# EasyEDA Pro project ProPrj_智能车主控V5.0-20251108_2026-08-26.epro, schematic Schematic2_1

## Sheets
1 P1: Assembly Variant: Basic; Board Name: Board1; Create Date: 2026-05-15; Page Name: P1; Project Name: 飞檐走壁V3.0; Schematic Name: Schematic2; Update Date: 2026-05-15; Company: 嘉立创EDA; Page Size: A4; Version: V1.0
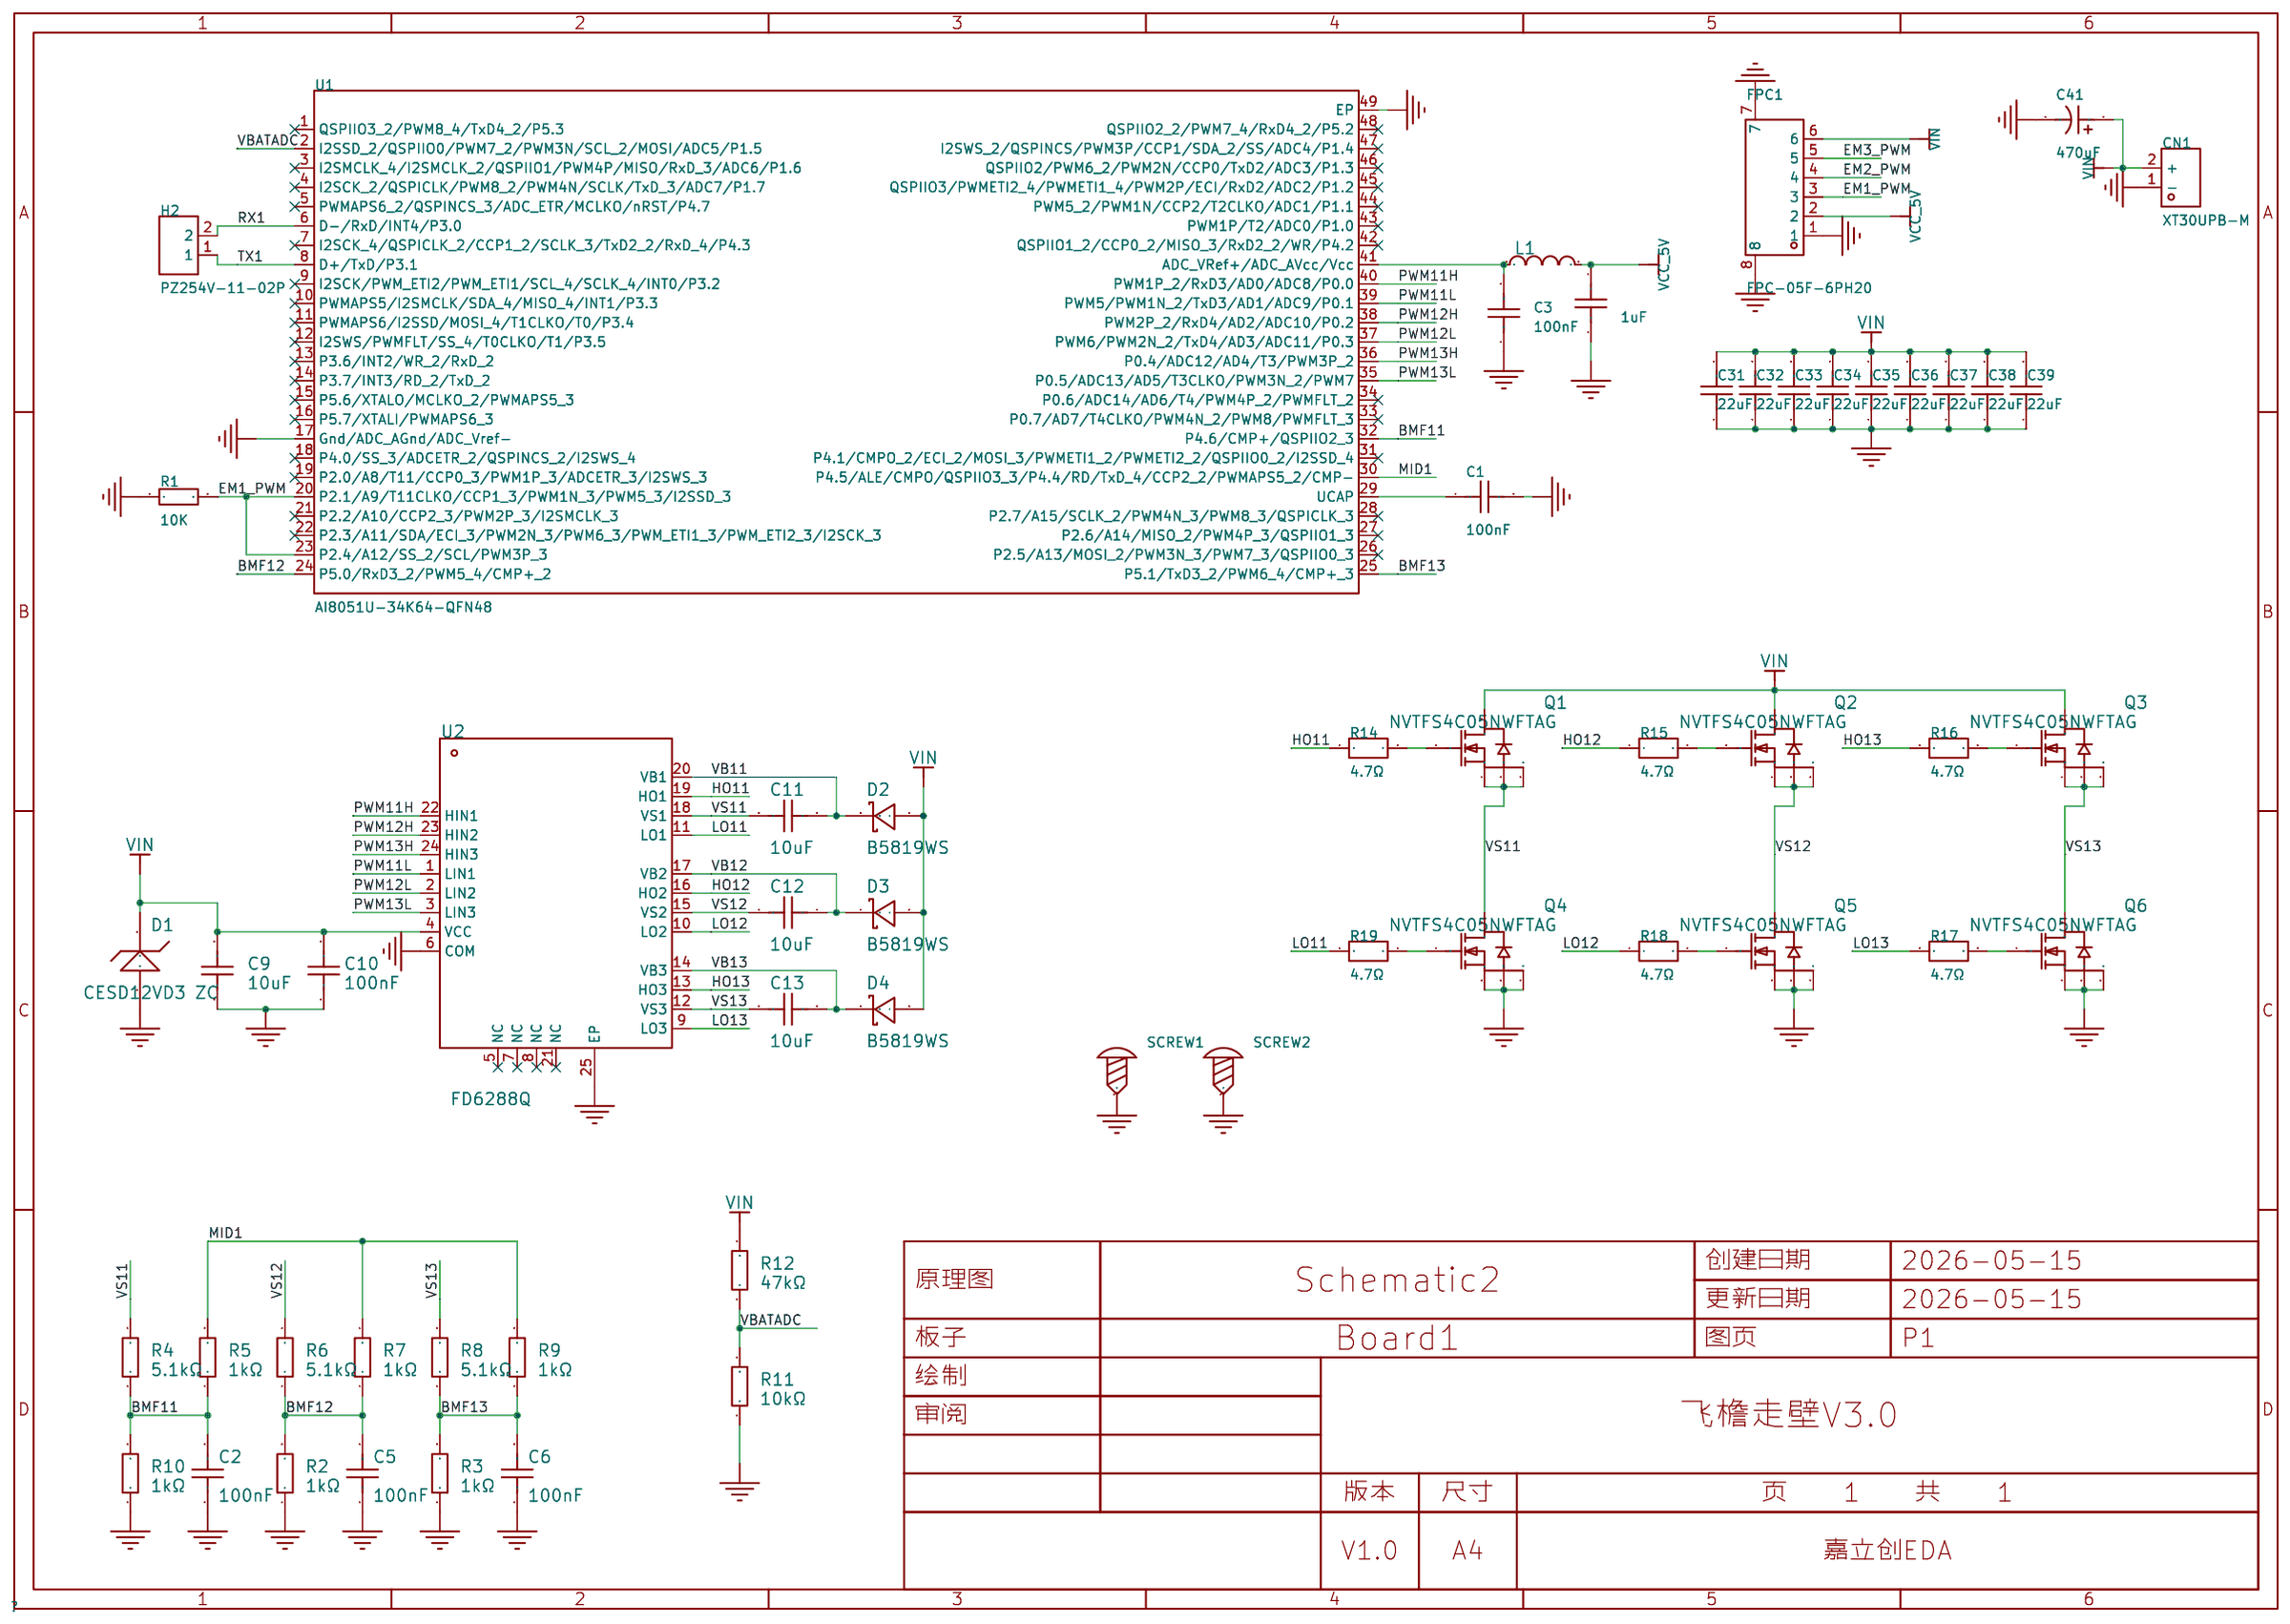
[diagram p2: P1]
2 P2: Board Name: 电调; Page Name: P2
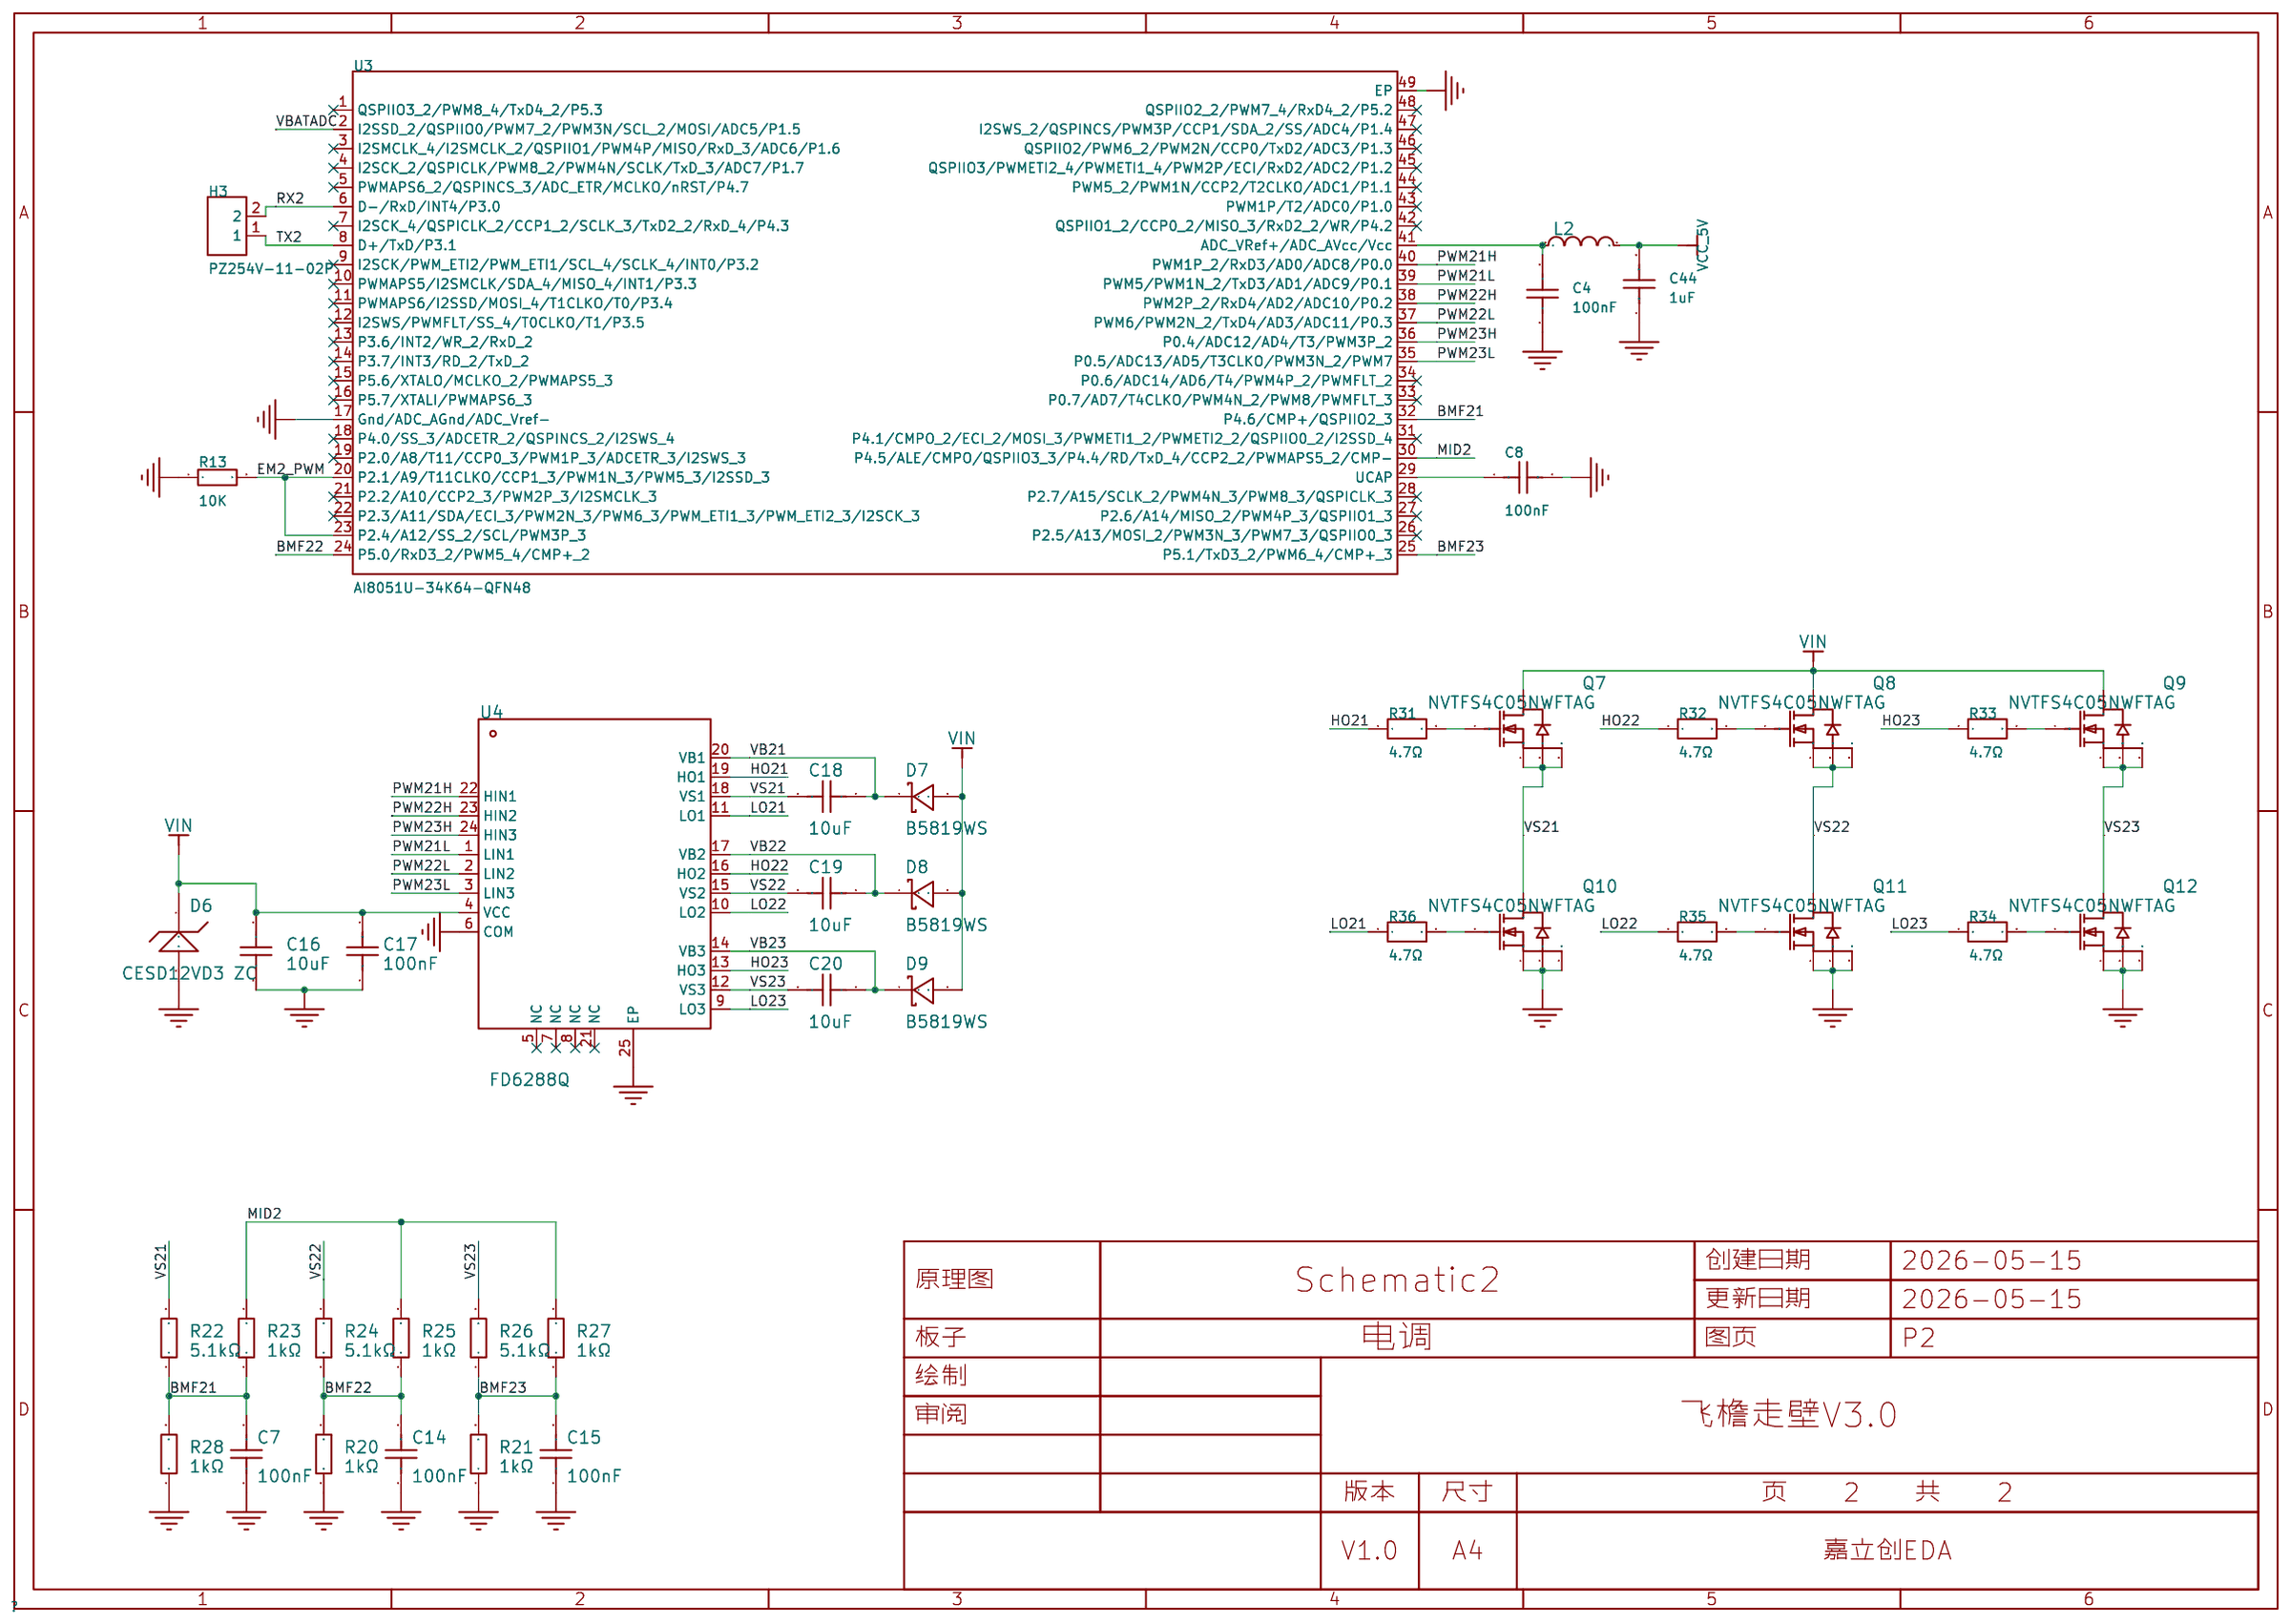
[diagram p3: P2]
3 P3: Board Name: 电调; Page Name: P3
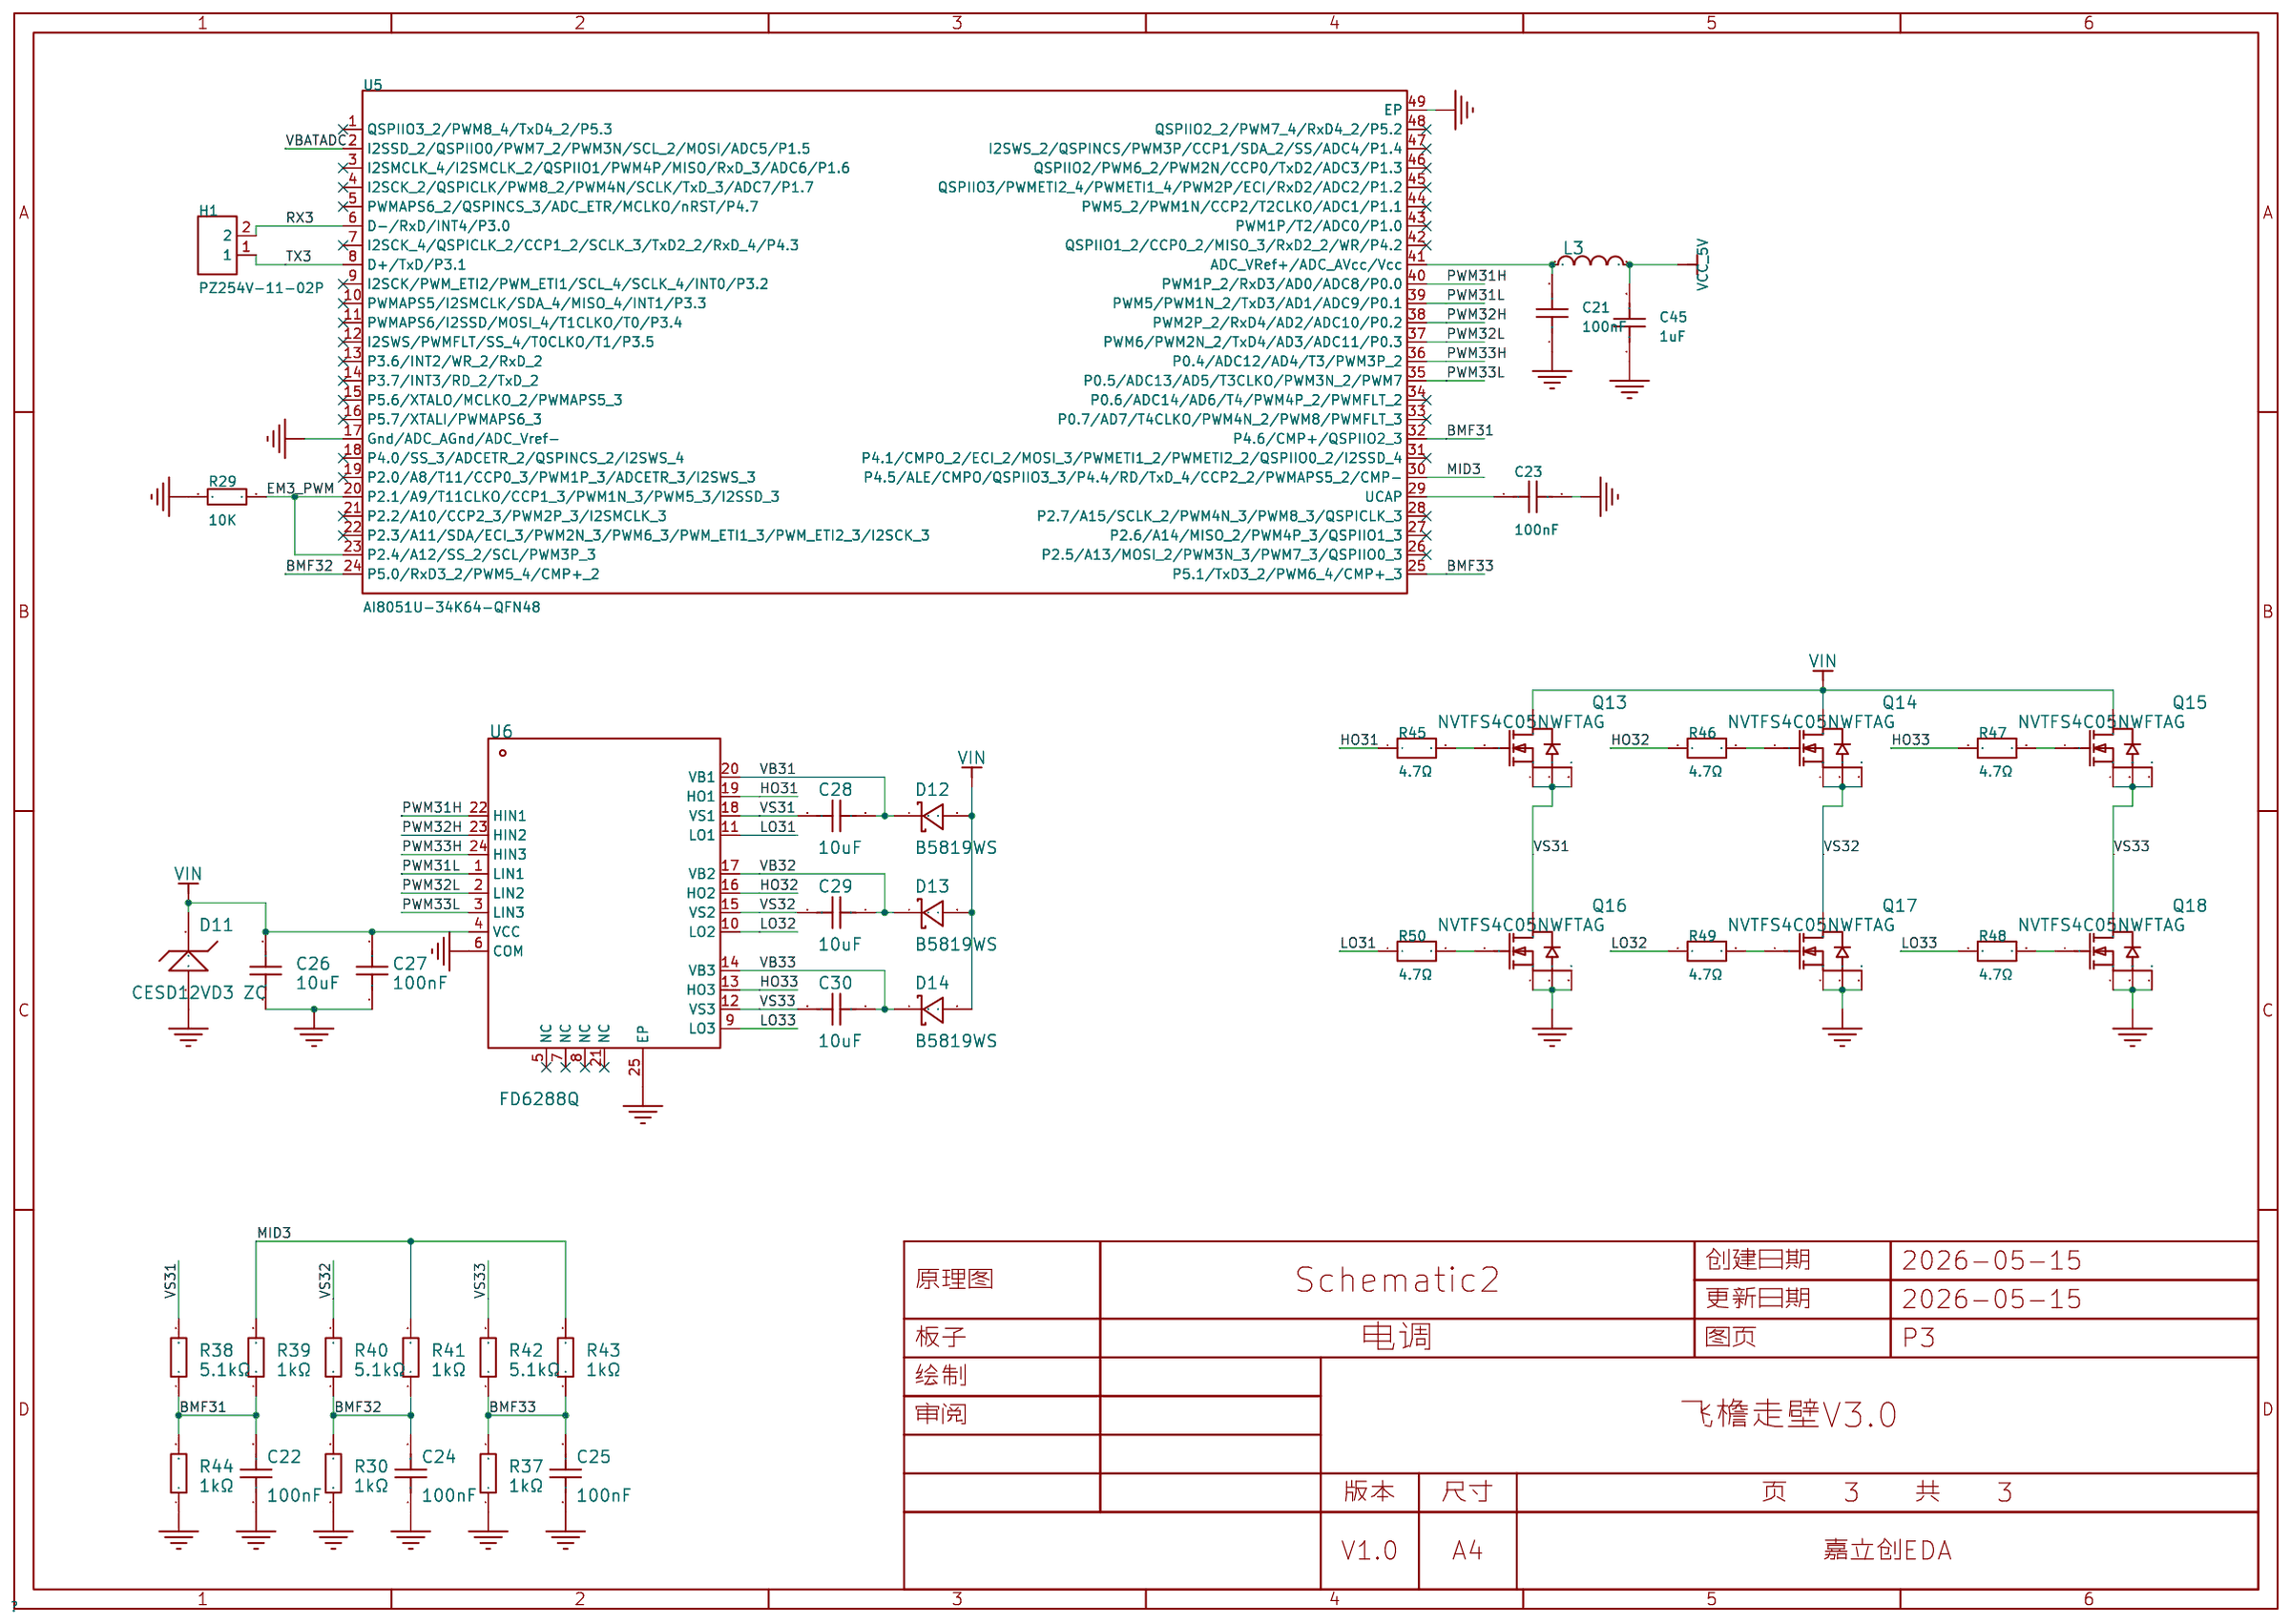
[diagram p4: P3]

## Parts
sheet P1
C1  100nF  [C0603]
C2  100nF  [C0603]
C3  100nF  [C0603]
C5  100nF  [C0603]
C6  100nF  [C0603]
C9  10uF  [C0603]
C10  100nF  [C0603]
C11  10uF  [C0603]
C12  10uF  [C0603]
C13  10uF  [C0603]
C31  22uF  [C0805]
C32  22uF  [C0805]
C33  22uF  [C0805]
C34  22uF  [C0805]
C35  22uF  [C0805]
C36  22uF  [C0805]
C37  22uF  [C0805]
C38  22uF  [C0805]
C39  22uF  [C0805]
C41  470uF  [CAP-TH_BD6.3-P2.50-D0.6-FD]
C42  1uF  [C0603]
CN1  XT30UPB-M  [CONN-TH_XT30UPB-M]
D1  CESD12VD3 ZC  [SOD-323_L1.8-W1.3-LS2.5-RD]
D2  B5819WS  [SOD-323_L1.8-W1.3-LS2.5-RD]
D3  B5819WS  [SOD-323_L1.8-W1.3-LS2.5-RD]
D4  B5819WS  [SOD-323_L1.8-W1.3-LS2.5-RD]
FPC1  FPC-05F-6PH20  [FPC-SMD_6P-P0.50_XUNPU_FPC-05F-6PH20]
H2  PZ254V-11-02P  [HDR-TH_2P-P2.54-V-M]
L1  BLM18EG221SN1D  [L0603]
Q1  NVTFS4C05NWFTAG  [WDFN-5_L3.3-W3.3-P0.65-BL]
Q2  NVTFS4C05NWFTAG  [WDFN-5_L3.3-W3.3-P0.65-BL]
Q3  NVTFS4C05NWFTAG  [WDFN-5_L3.3-W3.3-P0.65-BL]
Q4  NVTFS4C05NWFTAG  [WDFN-5_L3.3-W3.3-P0.65-BL]
Q5  NVTFS4C05NWFTAG  [WDFN-5_L3.3-W3.3-P0.65-BL]
Q6  NVTFS4C05NWFTAG  [WDFN-5_L3.3-W3.3-P0.65-BL]
R1  10K  [R0603]
R2  1kΩ  [R0603]
R3  1kΩ  [R0603]
R4  5.1kΩ  [R0603]
R5  1kΩ  [R0603]
R6  5.1kΩ  [R0603]
R7  1kΩ  [R0603]
R8  5.1kΩ  [R0603]
R9  1kΩ  [R0603]
R10  1kΩ  [R0603]
R11  10kΩ  [R0603]
R12  47kΩ  [R0603]
R14  4.7Ω  [R0603]
R15  4.7Ω  [R0603]
R16  4.7Ω  [R0603]
R17  4.7Ω  [R0603]
R18  4.7Ω  [R0603]
R19  4.7Ω  [R0603]
SCREW1  -  [M2螺丝]
SCREW2  -  [M2螺丝]
U1  AI8051U-34K64-QFN48  [UQFN-48_L6.0-W6.0-P0.40-BL-EP4.4]
U2  FD6288Q  [QFN-24_L4.0-W4.0-P0.50-BL-EP2.6]
sheet P2
C4  100nF  [C0603]
C7  100nF  [C0603]
C8  100nF  [C0603]
C14  100nF  [C0603]
C15  100nF  [C0603]
C16  10uF  [C0603]
C17  100nF  [C0603]
C18  10uF  [C0603]
C19  10uF  [C0603]
C20  10uF  [C0603]
C44  1uF  [C0603]
D6  CESD12VD3 ZC  [SOD-323_L1.8-W1.3-LS2.5-RD]
D7  B5819WS  [SOD-323_L1.8-W1.3-LS2.5-RD]
D8  B5819WS  [SOD-323_L1.8-W1.3-LS2.5-RD]
D9  B5819WS  [SOD-323_L1.8-W1.3-LS2.5-RD]
H3  PZ254V-11-02P  [HDR-TH_2P-P2.54-V-M]
L2  BLM18EG221SN1D  [L0603]
Q7  NVTFS4C05NWFTAG  [WDFN-5_L3.3-W3.3-P0.65-BL]
Q8  NVTFS4C05NWFTAG  [WDFN-5_L3.3-W3.3-P0.65-BL]
Q9  NVTFS4C05NWFTAG  [WDFN-5_L3.3-W3.3-P0.65-BL]
Q10  NVTFS4C05NWFTAG  [WDFN-5_L3.3-W3.3-P0.65-BL]
Q11  NVTFS4C05NWFTAG  [WDFN-5_L3.3-W3.3-P0.65-BL]
Q12  NVTFS4C05NWFTAG  [WDFN-5_L3.3-W3.3-P0.65-BL]
R13  10K  [R0603]
R20  1kΩ  [R0603]
R21  1kΩ  [R0603]
R22  5.1kΩ  [R0603]
R23  1kΩ  [R0603]
R24  5.1kΩ  [R0603]
R25  1kΩ  [R0603]
R26  5.1kΩ  [R0603]
R27  1kΩ  [R0603]
R28  1kΩ  [R0603]
R31  4.7Ω  [R0603]
R32  4.7Ω  [R0603]
R33  4.7Ω  [R0603]
R34  4.7Ω  [R0603]
R35  4.7Ω  [R0603]
R36  4.7Ω  [R0603]
U3  AI8051U-34K64-QFN48  [UQFN-48_L6.0-W6.0-P0.40-BL-EP4.4]
U4  FD6288Q  [QFN-24_L4.0-W4.0-P0.50-BL-EP2.6]
sheet P3
C21  100nF  [C0603]
C22  100nF  [C0603]
C23  100nF  [C0603]
C24  100nF  [C0603]
C25  100nF  [C0603]
C26  10uF  [C0603]
C27  100nF  [C0603]
C28  10uF  [C0603]
C29  10uF  [C0603]
C30  10uF  [C0603]
C45  1uF  [C0603]
D11  CESD12VD3 ZC  [SOD-323_L1.8-W1.3-LS2.5-RD]
D12  B5819WS  [SOD-323_L1.8-W1.3-LS2.5-RD]
D13  B5819WS  [SOD-323_L1.8-W1.3-LS2.5-RD]
D14  B5819WS  [SOD-323_L1.8-W1.3-LS2.5-RD]
H1  PZ254V-11-02P  [HDR-TH_2P-P2.54-V-M]
L3  BLM18EG221SN1D  [L0603]
Q13  NVTFS4C05NWFTAG  [WDFN-5_L3.3-W3.3-P0.65-BL]
Q14  NVTFS4C05NWFTAG  [WDFN-5_L3.3-W3.3-P0.65-BL]
Q15  NVTFS4C05NWFTAG  [WDFN-5_L3.3-W3.3-P0.65-BL]
Q16  NVTFS4C05NWFTAG  [WDFN-5_L3.3-W3.3-P0.65-BL]
Q17  NVTFS4C05NWFTAG  [WDFN-5_L3.3-W3.3-P0.65-BL]
Q18  NVTFS4C05NWFTAG  [WDFN-5_L3.3-W3.3-P0.65-BL]
R29  10K  [R0603]
R30  1kΩ  [R0603]
R37  1kΩ  [R0603]
R38  5.1kΩ  [R0603]
R39  1kΩ  [R0603]
R40  5.1kΩ  [R0603]
R41  1kΩ  [R0603]
R42  5.1kΩ  [R0603]
R43  1kΩ  [R0603]
R44  1kΩ  [R0603]
R45  4.7Ω  [R0603]
R46  4.7Ω  [R0603]
R47  4.7Ω  [R0603]
R48  4.7Ω  [R0603]
R49  4.7Ω  [R0603]
R50  4.7Ω  [R0603]
U5  AI8051U-34K64-QFN48  [UQFN-48_L6.0-W6.0-P0.40-BL-EP4.4]
U6  FD6288Q  [QFN-24_L4.0-W4.0-P0.50-BL-EP2.6]

## Library data of the parts
C1 C3 C4 C8 C21 C23 = CAP_0603: Supplier Footprint: 0603
C2 C5-C7 C10 C14 C15 C17 C22 C24 C25 C27 = AC0402KRX7R7BB104: 容值:100nF;精度:±10%;额定电压:16V;材质(温度系数):X7R;; LCSC Part Name: 100nF ±10% 16V; Supplier Part: C272879; Manufacturer: YAGEO(国巨); Supplier Footprint: 0402; JLCPCB Part Class: Extended Part; Datasheet: https://atta.szlcsc.com/upload/public/pdf/source/20190415/C272879_6D8AB4F790637CC3F619FD676B262AD9.pdf; Supplier: LCSC; Tolerance: ±10%; Voltage Rated: 16V; Temperature Coefficient: X7R
C9 C11-C13 C16 C18-C20 C26 C28-C30 = 0603X106M250NT: 容值:10uF;精度:±20%;额定电压:25V;材质(温度系数):X5R;; LCSC Part Name: 10uF ±20% 25V; Supplier Part: C479655; Manufacturer: FH(风华); Supplier Footprint: 0603; JLCPCB Part Class: Extended Part; Datasheet: https://atta.szlcsc.com/upload/public/pdf/source/20200107/C479655_D3C847DA741305EF09EE66E759171083.pdf; Supplier: LCSC; Tolerance: ±20%; Voltage Rated: 25V; Temperature Coefficient: X5R
C31-C39 = CGA0805X5R226M350MT: 容值:22uF;精度:±20%;额定电压:35V;温度系数:X5R;; LCSC Part Name: 22uF ±20% 35V; Supplier Part: C6119901; Manufacturer: HRE(芯声); Supplier Footprint: 0805; JLCPCB Part Class: Extended Part; Datasheet: https://item.szlcsc.com/datasheet/CGA0805X5R226M350MT/7062607.html; Supplier: LCSC; Tolerance: ±20%; Voltage Rating: 35V; Temperature Coefficient: X5R
C41 = PA25V470M6x12: 容值:470uF;精度:±20%;额定电压:25V;纹波电流:3.8A@100kHz;等效串联电阻(ESR):25mΩ@100kHz;类型:聚合物;; LCSC Part Name: 470uF ±20% 25V; Supplier Part: C46550440; Manufacturer: JIERR(捷而瑞); Supplier Footprint: 插件,D6.3xL12mm; JLCPCB Part Class: Extended Part; Datasheet: https://item.szlcsc.com/datasheet/PA25V470M6x12/48680134.html; Supplier: LCSC; Tolerance: ±20%; Voltage Rating: 25V; Ripple Current: 3.8A@100kHz; Equivalent Series Resistance(ESR): 25mΩ@100kHz; Type: 聚合物; Pin Spacing: 2.5mm; Diameter: 6.3mm; Height - Seated (Max): 12mm; Lifetime: 2000hrs@105℃; Operating Temperature: -55℃~+105℃
C42 C44 C45 = CGA0402X5R105K500GT: 容值:1uF;精度:±10%;额定电压:50V;温度系数:X5R;; LCSC Part Name: 1uF ±10% 50V; Supplier Part: C6119811; Manufacturer: HRE(芯声); Supplier Footprint: 0402; JLCPCB Part Class: Extended Part; Datasheet: https://item.szlcsc.com/datasheet/CGA0402X5R105K500GT/7062517.html; Supplier: LCSC; Tolerance: ±10%; Voltage Rating: 50V; Temperature Coefficient: X5R
CN1 = XT30UPB-M: LCSC Part Name: AMASS(艾迈斯)板载立式 航模锂电池控制器连接器插头 PCB板立式 公头XT30UPB-M.G.Y; Supplier Part: C428721; Manufacturer: AMASS(艾迈斯); JLCPCB Part Class: Extended Part; Datasheet: https://item.szlcsc.com/datasheet/XT30UPB-M/423831.html; Supplier: LCSC; Rated current: 15A; Rated voltage: 500VDC; colour: 黄色; Connector type: 航模插头; contact resistance: 0.65mΩ; interface form: 公头; insulating material: PA; metal material: 镀金
D1 D6 D11 = CESD12VD3 ZC: 极性:单向;反向截止电压(Vrwm):12V;最大钳位电压:24V;峰值脉冲电流(Ipp)@10/1000us:9A;击穿电压:13.3V;; LCSC Part Name: 单向ESD; Supplier Part: C22646; Manufacturer: CJ(江苏长电/长晶); Supplier Footprint: SOD-323; JLCPCB Part Class: Extended Part; Datasheet: https://atta.szlcsc.com/upload/public/pdf/source/20170601/1496285788165.pdf; Supplier: LCSC; polarity: 单向; Reverse Stand-Off Voltage (Vrwm): 12V; Maximum Clamping Voltage: 24V; Peak Pulse Current (Ipp)@10/1000us: 9A; Breakdown Voltage: 13.3V; Type: ESD
D2-D4 D7-D9 D12-D14 = B5819WS_C22624: 正向压降(Vf):600mV@1A;直流反向耐压(Vr):40V;平均整流电流(Io):1A;; LCSC Part Name: 电压:40V 电流:1A; Supplier Part: C22624; Manufacturer: CJ(江苏长电/长晶); Supplier Footprint: SOD-323; JLCPCB Part Class: 扩展库; Datasheet: https://atta.szlcsc.com/upload/public/pdf/source/20150407/1457707273359.pdf; Supplier: LCSC; Forward Voltage (Vf@If): 600mV@1A; Reverse Voltage (Vr): 40V; Average Rectified Current (Io): 1A
FPC1 = FPC-05F-6PH20: 锁定特性:翻盖式;触点类型:卧贴;触点数量:6P;间距:0.5mm;安装方式:下接;工作温度:-25℃~+85℃;; LCSC Part Name: 翻盖式 卧贴 P数:6P 间距:0.5mm; Supplier Part: C2856796; Manufacturer: XUNPU(讯普); Supplier Footprint: SMD,P=0.5mm,卧贴; JLCPCB Part Class: Extended Part; Datasheet: https://item.szlcsc.com/datasheet/FPC-05F-6PH20/3056894.html; Supplier: LCSC; Locking Feature: 翻盖式; Contact Type: 卧贴; Number of Contacts: 6P; Pitch: 0.5mm; Mounting Type: 下接; FFC, FCB Thickness: 0.3mm; Height Above Board: 2mm; Contact Material: 磷青铜; Contact Plating: 锡; Operating Temperature: -25℃~+85℃; Rated Voltage (Max): 50V; Current Rating (Max): 500mA
H1-H3 = PZ254V-11-02P: 插针结构:1x2P;间距:2.54mm;行距:-;圆针/方针:方针;安装方式:直插;排数:单排;总PIN位数:2P;额定电流:3A;额定电压:250V;配合针长度:6mm;塑高:2.5mm;端接针长度:3mm;触头材质:黄铜;触头镀层:-;工作温度:-40℃~+105℃;颜色:黑色;; LCSC Part Name: 1x2P 间距:2.54mm 方针 直插; Supplier Part: C492401; Manufacturer: XFCN(兴飞); Supplier Footprint: 插件,P=2.54mm; JLCPCB Part Class: Extended Part; Datasheet: https://item.szlcsc.com/datasheet/PZ254V-11-02P/502957.html; Supplier: LCSC; Pin Structure: 1x2P; Pitch: 2.54mm; Circluar Pins/Square Pins: 方针; Mounting Type: 直插; Number of Rows: 单排; Number of Pins: 2P; Current Rating: 3A; Voltage Rating (Max): 250V; Length of Mating Pin: 6mm; Insulation Height: 2.5mm; Length of End Connection Pin: 3mm; Contact Material: 黄铜; Operating Temperature: -40℃~+105℃; Color: 黑色
L1-L3 = BLM18EG221SN1D: 标称阻抗@测试频率:220Ω@100MHz;误差:±25%;直流电阻(RDC):50mΩ;; LCSC Part Name: 单路 0603磁珠 阻抗220Ω@100MHz; Supplier Part: C85827; Manufacturer: muRata(村田); Supplier Footprint: 0603; JLCPCB Part Class: Extended Part; Datasheet: https://atta.szlcsc.com/upload/public/pdf/source/20170523/1495533955417.pdf; Supplier: LCSC; Impedance @ Frequency: 220Ω@100MHz; Tolerance: ±25%; DC Resistance: 50mΩ; Current Rating: 2A; Circuits: 1
Q1-Q18 = NVTFS4C05NWFTAG: 类型:1个N沟道;漏源电压(Vdss):30V;连续漏极电流(Id):102A;导通电阻(RDS(on)):3.6mΩ@10V,102A;耗散功率(Pd):68W;阈值电压(Vgs(th)):2.2V;; LCSC Part Name: 1个N沟道 耐压:30V 电流:102A; Supplier Part: C604634; Manufacturer: onsemi(安森美); Supplier Footprint: WDFN-5(3.3x3.3); JLCPCB Part Class: 扩展库; Datasheet: https://atta.szlcsc.com/upload/public/pdf/source/20210809/C604634_D94154363E834B4E195887A2CBF2F5C4.pdf; Supplier: LCSC; Type: 1个N沟道; Drain to Source Voltage: 30V; Current - Continuous Drain(Id): 102A; RDS(on): 3.6mΩ@10V,102A; Pd - Power Dissipation: 68W; Gate Threshold Voltage (Vgs(th)@Id): 2.2V; Gate Charge(Qg): 31nC@10V; Input Capacitance(Ciss@Vds): 1.988nF@15V; Reverse Transfer Capacitance (Crss@Vds): 71pF@15V; Operating Temperature: -55℃~+175℃
R1 R13 R29 = Res_0603: Supplier Footprint: 0603
R2 R3 R5 R7 R9 R10 R20 R21 R23 R25 R27 R28 R30 R37 R39 R41 R43 R44 = 0402WGJ0102TCE: 电阻类型:厚膜电阻;阻值:1kΩ;精度:±5%;功率:62.5mW;温度系数:±100ppm/℃;最大工作电压:50V;工作温度范围:-55℃~+155℃;; LCSC Part Name: 1kΩ ±5% 62.5mW; Supplier Part: C25543; Manufacturer: UNI-ROYAL(厚声); Supplier Footprint: 0402; JLCPCB Part Class: Extended Part; Datasheet: https://atta.szlcsc.com/upload/public/pdf/source/20200306/C422600_1E6D84923E4A46A82E41ADD87F860B5C.pdf; Supplier: LCSC; Type: 厚膜电阻; Tolerance: ±5%; Power(Watts): 62.5mW; Temperature Coefficient: ±100ppm/℃; Overload Voltage (Max): 50V; Operating Temperature Range: -55℃~+155℃
R4 R6 R8 R22 R24 R26 R38 R40 R42 = 0402WGJ0512TCE: 电阻类型:厚膜电阻;阻值:5.1kΩ;精度:±5%;功率:1/16W;温度系数:±100ppm/℃;最大工作电压:50V;工作温度范围:-55℃~+155℃;; LCSC Part Name: 5.1kΩ ±5%; Supplier Part: C25941; Manufacturer: UNI-ROYAL(厚声); Supplier Footprint: 0402; JLCPCB Part Class: Extended Part; Datasheet: https://atta.szlcsc.com/upload/public/pdf/source/20200306/C422600_1E6D84923E4A46A82E41ADD87F860B5C.pdf; Supplier: LCSC; Type: 厚膜电阻; Tolerance: ±5%; Power(Watts): 1/16W; Temperature Coefficient: ±100ppm/℃; Overload Voltage (Max): 50V; Operating Temperature Range: -55℃~+155℃
R11 = 0402WGF1002TCE: 电阻类型:厚膜电阻;阻值:10kΩ;精度:±1%;功率:62.5mW;温度系数:±100ppm/℃;最大工作电压:50V;工作温度范围:-55℃~+155℃;; LCSC Part Name: 10kΩ ±1% 62.5mW; Supplier Part: C25744; Manufacturer: UNI-ROYAL(厚声); Supplier Footprint: 0402; JLCPCB Part Class: Basic Part; Datasheet: https://atta.szlcsc.com/upload/public/pdf/source/20200306/C422600_1E6D84923E4A46A82E41ADD87F860B5C.pdf; Supplier: LCSC; Type: 厚膜电阻; Tolerance: ±1%; Power(Watts): 62.5mW; Temperature Coefficient: ±100ppm/℃; Overload Voltage (Max): 50V; Operating Temperature Range: -55℃~+155℃
R12 = AC0402FR-0747KL: 电阻类型:厚膜电阻;阻值:47kΩ;精度:±1%;功率:62.5mW;温度系数:±100ppm/℃;最大工作电压:50V;工作温度范围:-55℃~+155℃;; LCSC Part Name: 47kΩ ±1% 62.5mW; Supplier Part: C144757; Manufacturer: YAGEO(国巨); Supplier Footprint: 0402; JLCPCB Part Class: Extended Part; Datasheet: https://atta.szlcsc.com/upload/public/pdf/source/20171225/C144757_15141880693081202986.pdf; Supplier: LCSC; Type: 厚膜电阻; Tolerance: ±1%; Power(Watts): 62.5mW; Temperature Coefficient: ±100ppm/℃; Overload Voltage (Max): 50V; Operating Temperature Range: -55℃~+155℃
R14-R19 R31-R36 R45-R50 = FRC0603J4R7 TS: 电阻类型:厚膜电阻;阻值:4.7Ω;精度:±5%;功率:100mW;工作电压:75V;温度系数:±200ppm/℃;; LCSC Part Name: 4.7Ω ±5% 100mW 厚膜电阻; Supplier Part: C2907168; Manufacturer: FOJAN(富捷); Supplier Footprint: 0603; JLCPCB Part Class: Extended Part; Supplier: LCSC; Type: 厚膜电阻; Tolerance: ±5%; Power(Watts): 100mW; Voltage-Supply(Max): 75V; Temperature Coefficient: ±200ppm/℃; Operating Temperature: -55℃~+155℃
SCREW1 SCREW2 = M2螺丝: Supplier Footprint: 插件
U1 U3 U5 = AI8051U-34K64-QFN48: 硬件浮点/硬件三角函数 跑100MHz, 32位8051-CPU 跑 42MHz，PWM 有硬件移相功能，DMA支持外设到外设，DMA支持PWM; LCSC Part Name: 单片机(MCU/MPU/SOC); Supplier Part: C42388166; Manufacturer: STC; Supplier Footprint: QFN-48-EP(6x6); JLCPCB Part Class: Extended Part; Datasheet: https://item.szlcsc.com/datasheet/AI8051U-34K64-QFN48/44315051.html; Supplier: LCSC
U2 U4 U6 = FD6288Q: Supplier Part: C328453; Manufacturer: Fortior Tech(峰岹); Supplier Footprint: QFN-24-EP(4x4); JLCPCB Part Class: 扩展库; Datasheet: https://atta.szlcsc.com/upload/public/pdf/source/20241101/0E2856EB301EAFFED732065FB088D773.pdf; Supplier: LCSC

## Nets
GND: C1.2 C2.1 C3.1 C4.1 C5.1 C6.1 C7.1 C8.2 C9.1 C10.1 C14.1 C15.1 C16.1 C17.1 C21.1 C22.1 C23.2 C24.1 C25.1 C26.1 C27.1 C31.1 C32.1 C33.1 C34.1 C35.1 C36.1 C37.1 C38.1 C39.1 C41.2 C42.2 C44.1 C45.1 CN1.1(-) D1.2 D6.2 D11.2 FPC1.1 FPC1.7 FPC1.8 Q4.1(S) Q4.2(S) Q4.3(S) Q5.1(S) Q5.2(S) Q5.3(S) Q6.1(S) Q6.2(S) Q6.3(S) Q10.1(S) Q10.2(S) Q10.3(S) Q11.1(S) Q11.2(S) Q11.3(S) Q12.1(S) Q12.2(S) Q12.3(S) Q16.1(S) Q16.2(S) Q16.3(S) Q17.1(S) Q17.2(S) Q17.3(S) Q18.1(S) Q18.2(S) Q18.3(S) R1.1 R2.1 R3.1 R10.1 R11.1 R13.1 R20.1 R21.1 R28.1 R29.1 R30.1 R37.1 R44.1 SCREW1.1 SCREW2.1 U1.17(Gnd/ADC_AGnd/ADC_Vref-) U1.49(EP) U2.6(COM) U2.25(EP) U3.17(Gnd/ADC_AGnd/ADC_Vref-) U3.49(EP) U4.6(COM) U4.25(EP) U5.17(Gnd/ADC_AGnd/ADC_Vref-) U5.49(EP) U6.6(COM) U6.25(EP)
VBATADC: R11.2 R12.1 U1.2(I2SSD_2/QSPIIO0/PWM7_2/PWM3N/SCL_2/MOSI/ADC5/P1.5) U3.2(I2SSD_2/QSPIIO0/PWM7_2/PWM3N/SCL_2/MOSI/ADC5/P1.5) U5.2(I2SSD_2/QSPIIO0/PWM7_2/PWM3N/SCL_2/MOSI/ADC5/P1.5)
VCC_5V: C42.1 C44.2 C45.2 FPC1.2 L1.2 L2.2 L3.2
VIN: C9.2 C10.2 C16.2 C17.2 C26.2 C27.2 C31.2 C32.2 C33.2 C34.2 C35.2 C36.2 C37.2 C38.2 C39.2 C41.1 CN1.2(+) D1.1 D2.2(A) D3.2(A) D4.2(A) D6.1 D7.2(A) D8.2(A) D9.2(A) D11.1 D12.2(A) D13.2(A) D14.2(A) FPC1.6 Q1.5(D) Q2.5(D) Q3.5(D) Q7.5(D) Q8.5(D) Q9.5(D) Q13.5(D) Q14.5(D) Q15.5(D) R12.2 U2.4(VCC) U4.4(VCC) U6.4(VCC)
BMF11: C2.2 R4.1 R5.1 R10.2 U1.32(P4.6/CMP+/QSPIIO2_3)
BMF12: C5.2 R2.2 R6.1 R7.1 U1.24(P5.0/RxD3_2/PWM5_4/CMP+_2)
BMF13: C6.2 R3.2 R8.1 R9.1 U1.25(P5.1/TxD3_2/PWM6_4/CMP+_3)
BMF21: C7.2 R22.1 R23.1 R28.2 U3.32(P4.6/CMP+/QSPIIO2_3)
BMF22: C14.2 R20.2 R24.1 R25.1 U3.24(P5.0/RxD3_2/PWM5_4/CMP+_2)
BMF23: C15.2 R21.2 R26.1 R27.1 U3.25(P5.1/TxD3_2/PWM6_4/CMP+_3)
BMF31: C22.2 R38.1 R39.1 R44.2 U5.32(P4.6/CMP+/QSPIIO2_3)
BMF32: C24.2 R30.2 R40.1 R41.1 U5.24(P5.0/RxD3_2/PWM5_4/CMP+_2)
BMF33: C25.2 R37.2 R42.1 R43.1 U5.25(P5.1/TxD3_2/PWM6_4/CMP+_3)
EM1_PWM: FPC1.3 R1.2 U1.20(P2.1/A9/T11CLKO/CCP1_3/PWM1N_3/PWM5_3/I2SSD_3) U1.23(P2.4/A12/SS_2/SCL/PWM3P_3)
EM2_PWM: FPC1.4 R13.2 U3.20(P2.1/A9/T11CLKO/CCP1_3/PWM1N_3/PWM5_3/I2SSD_3) U3.23(P2.4/A12/SS_2/SCL/PWM3P_3)
EM3_PWM: FPC1.5 R29.2 U5.20(P2.1/A9/T11CLKO/CCP1_3/PWM1N_3/PWM5_3/I2SSD_3) U5.23(P2.4/A12/SS_2/SCL/PWM3P_3)
HO11: R14.1 U2.19(HO1)
HO12: R15.1 U2.16(HO2)
HO13: R16.1 U2.13(HO3)
HO21: R31.1 U4.19(HO1)
HO22: R32.1 U4.16(HO2)
HO23: R33.1 U4.13(HO3)
HO31: R45.1 U6.19(HO1)
HO32: R46.1 U6.16(HO2)
HO33: R47.1 U6.13(HO3)
LO11: R19.1 U2.11(LO1)
LO12: R18.1 U2.10(LO2)
LO13: R17.1 U2.9(LO3)
LO21: R36.1 U4.11(LO1)
LO22: R35.1 U4.10(LO2)
LO23: R34.1 U4.9(LO3)
LO31: R50.1 U6.11(LO1)
LO32: R49.1 U6.10(LO2)
LO33: R48.1 U6.9(LO3)
MID1: R5.2 R7.2 R9.2 U1.30(P4.5/ALE/CMPO/QSPIIO3_3/P4.4/RD/TxD_4/CCP2_2/PWMAPS5_2/CMP-)
MID2: R23.2 R25.2 R27.2 U3.30(P4.5/ALE/CMPO/QSPIIO3_3/P4.4/RD/TxD_4/CCP2_2/PWMAPS5_2/CMP-)
MID3: R39.2 R41.2 R43.2 U5.30(P4.5/ALE/CMPO/QSPIIO3_3/P4.4/RD/TxD_4/CCP2_2/PWMAPS5_2/CMP-)
PWM11H: U1.40(PWM1P_2/RxD3/AD0/ADC8/P0.0) U2.22(HIN1)
PWM11L: U1.39(PWM5/PWM1N_2/TxD3/AD1/ADC9/P0.1) U2.1(LIN1)
PWM12H: U1.38(PWM2P_2/RxD4/AD2/ADC10/P0.2) U2.23(HIN2)
PWM12L: U1.37(PWM6/PWM2N_2/TxD4/AD3/ADC11/P0.3) U2.2(LIN2)
PWM13H: U1.36(P0.4/ADC12/AD4/T3/PWM3P_2) U2.24(HIN3)
PWM13L: U1.35(P0.5/ADC13/AD5/T3CLKO/PWM3N_2/PWM7) U2.3(LIN3)
PWM21H: U3.40(PWM1P_2/RxD3/AD0/ADC8/P0.0) U4.22(HIN1)
PWM21L: U3.39(PWM5/PWM1N_2/TxD3/AD1/ADC9/P0.1) U4.1(LIN1)
PWM22H: U3.38(PWM2P_2/RxD4/AD2/ADC10/P0.2) U4.23(HIN2)
PWM22L: U3.37(PWM6/PWM2N_2/TxD4/AD3/ADC11/P0.3) U4.2(LIN2)
PWM23H: U3.36(P0.4/ADC12/AD4/T3/PWM3P_2) U4.24(HIN3)
PWM23L: U3.35(P0.5/ADC13/AD5/T3CLKO/PWM3N_2/PWM7) U4.3(LIN3)
PWM31H: U5.40(PWM1P_2/RxD3/AD0/ADC8/P0.0) U6.22(HIN1)
PWM31L: U5.39(PWM5/PWM1N_2/TxD3/AD1/ADC9/P0.1) U6.1(LIN1)
PWM32H: U5.38(PWM2P_2/RxD4/AD2/ADC10/P0.2) U6.23(HIN2)
PWM32L: U5.37(PWM6/PWM2N_2/TxD4/AD3/ADC11/P0.3) U6.2(LIN2)
PWM33H: U5.36(P0.4/ADC12/AD4/T3/PWM3P_2) U6.24(HIN3)
PWM33L: U5.35(P0.5/ADC13/AD5/T3CLKO/PWM3N_2/PWM7) U6.3(LIN3)
RX1: H2.2 U1.6(D-/RxD/INT4/P3.0)
RX2: H3.2 U3.6(D-/RxD/INT4/P3.0)
RX3: H1.2 U5.6(D-/RxD/INT4/P3.0)
TX1: H2.1 U1.8(D+/TxD/P3.1)
TX2: H3.1 U3.8(D+/TxD/P3.1)
TX3: H1.1 U5.8(D+/TxD/P3.1)
VB11: C11.1 D2.1(K) U2.20(VB1)
VB12: C12.1 D3.1(K) U2.17(VB2)
VB13: C13.1 D4.1(K) U2.14(VB3)
VB21: C18.1 D7.1(K) U4.20(VB1)
VB22: C19.1 D8.1(K) U4.17(VB2)
VB23: C20.1 D9.1(K) U4.14(VB3)
VB31: C28.1 D12.1(K) U6.20(VB1)
VB32: C29.1 D13.1(K) U6.17(VB2)
VB33: C30.1 D14.1(K) U6.14(VB3)
VS11: C11.2 Q1.1(S) Q1.2(S) Q1.3(S) Q4.5(D) R4.2 U2.18(VS1)
VS12: C12.2 Q2.1(S) Q2.2(S) Q2.3(S) Q5.5(D) R6.2 U2.15(VS2)
VS13: C13.2 Q3.1(S) Q3.2(S) Q3.3(S) Q6.5(D) R8.2 U2.12(VS3)
VS21: C18.2 Q7.1(S) Q7.2(S) Q7.3(S) Q10.5(D) R22.2 U4.18(VS1)
VS22: C19.2 Q8.1(S) Q8.2(S) Q8.3(S) Q11.5(D) R24.2 U4.15(VS2)
VS23: C20.2 Q9.1(S) Q9.2(S) Q9.3(S) Q12.5(D) R26.2 U4.12(VS3)
VS31: C28.2 Q13.1(S) Q13.2(S) Q13.3(S) Q16.5(D) R38.2 U6.18(VS1)
VS32: C29.2 Q14.1(S) Q14.2(S) Q14.3(S) Q17.5(D) R40.2 U6.15(VS2)
VS33: C30.2 Q15.1(S) Q15.2(S) Q15.3(S) Q18.5(D) R42.2 U6.12(VS3)
$1N25: C1.1 U1.29(UCAP)
$1N26: C3.2 L1.1 U1.41(ADC_VRef+/ADC_AVcc/Vcc)
$1N98: Q6.4(G) R17.2
$1N100: Q3.4(G) R16.2
$1N102: Q5.4(G) R18.2
$1N104: Q2.4(G) R15.2
$1N106: Q4.4(G) R19.2
$1N108: Q1.4(G) R14.2
$2N27: C8.1 U3.29(UCAP)
$2N28: C4.2 L2.1 U3.41(ADC_VRef+/ADC_AVcc/Vcc)
$2N44: Q12.4(G) R34.2
$2N46: Q9.4(G) R33.2
$2N48: Q11.4(G) R35.2
$2N50: Q8.4(G) R32.2
$2N52: Q10.4(G) R36.2
$2N54: Q7.4(G) R31.2
$3N19: C23.1 U5.29(UCAP)
$3N20: C21.2 L3.1 U5.41(ADC_VRef+/ADC_AVcc/Vcc)
$3N36: Q18.4(G) R48.2
$3N38: Q15.4(G) R47.2
$3N40: Q17.4(G) R49.2
$3N42: Q14.4(G) R46.2
$3N44: Q16.4(G) R50.2
$3N46: Q13.4(G) R45.2

Not connected (* = marked no-connect by the designer): U1 1(QSPIIO3_2/PWM8_4/TxD4_2/P5.3)* 3(I2SMCLK_4/I2SMCLK_2/QSPIIO1/PWM4P/MISO/RxD_3/ADC6/P1.6)* 4(I2SCK_2/QSPICLK/PWM8_2/PWM4N/SCLK/TxD_3/ADC7/P1.7)* 5(PWMAPS6_2/QSPINCS_3/ADC_ETR/MCLKO/nRST/P4.7)* 7(I2SCK_4/QSPICLK_2/CCP1_2/SCLK_3/TxD2_2/RxD_4/P4.3)* 9(I2SCK/PWM_ETI2/PWM_ETI1/SCL_4/SCLK_4/INT0/P3.2)* 10(PWMAPS5/I2SMCLK/SDA_4/MISO_4/INT1/P3.3)* 11(PWMAPS6/I2SSD/MOSI_4/T1CLKO/T0/P3.4)* 12(I2SWS/PWMFLT/SS_4/T0CLKO/T1/P3.5)* 13(P3.6/INT2/WR_2/RxD_2)* 14(P3.7/INT3/RD_2/TxD_2)* 15(P5.6/XTALO/MCLKO_2/PWMAPS5_3)* 16(P5.7/XTALI/PWMAPS6_3)* 18(P4.0/SS_3/ADCETR_2/QSPINCS_2/I2SWS_4)* 19(P2.0/A8/T11/CCP0_3/PWM1P_3/ADCETR_3/I2SWS_3)* 21(P2.2/A10/CCP2_3/PWM2P_3/I2SMCLK_3)* 22(P2.3/A11/SDA/ECI_3/PWM2N_3/PWM6_3/PWM_ETI1_3/PWM_ETI2_3/I2SCK_3)* 26(P2.5/A13/MOSI_2/PWM3N_3/PWM7_3/QSPIIO0_3)* 27(P2.6/A14/MISO_2/PWM4P_3/QSPIIO1_3)* 28(P2.7/A15/SCLK_2/PWM4N_3/PWM8_3/QSPICLK_3)* 31(P4.1/CMPO_2/ECI_2/MOSI_3/PWMETI1_2/PWMETI2_2/QSPIIO0_2/I2SSD_4)* 33(P0.7/AD7/T4CLKO/PWM4N_2/PWM8/PWMFLT_3)* 34(P0.6/ADC14/AD6/T4/PWM4P_2/PWMFLT_2)* 42(QSPIIO1_2/CCP0_2/MISO_3/RxD2_2/WR/P4.2)* 43(PWM1P/T2/ADC0/P1.0)* 44(PWM5_2/PWM1N/CCP2/T2CLKO/ADC1/P1.1)* 45(QSPIIO3/PWMETI2_4/PWMETI1_4/PWM2P/ECI/RxD2/ADC2/P1.2)* 46(QSPIIO2/PWM6_2/PWM2N/CCP0/TxD2/ADC3/P1.3)* 47(I2SWS_2/QSPINCS/PWM3P/CCP1/SDA_2/SS/ADC4/P1.4)* 48(QSPIIO2_2/PWM7_4/RxD4_2/P5.2)*; U2 5(NC)* 7(NC)* 8(NC)* 21(NC)*; U3 1(QSPIIO3_2/PWM8_4/TxD4_2/P5.3)* 3(I2SMCLK_4/I2SMCLK_2/QSPIIO1/PWM4P/MISO/RxD_3/ADC6/P1.6)* 4(I2SCK_2/QSPICLK/PWM8_2/PWM4N/SCLK/TxD_3/ADC7/P1.7)* 5(PWMAPS6_2/QSPINCS_3/ADC_ETR/MCLKO/nRST/P4.7)* 7(I2SCK_4/QSPICLK_2/CCP1_2/SCLK_3/TxD2_2/RxD_4/P4.3)* 9(I2SCK/PWM_ETI2/PWM_ETI1/SCL_4/SCLK_4/INT0/P3.2)* 10(PWMAPS5/I2SMCLK/SDA_4/MISO_4/INT1/P3.3)* 11(PWMAPS6/I2SSD/MOSI_4/T1CLKO/T0/P3.4)* 12(I2SWS/PWMFLT/SS_4/T0CLKO/T1/P3.5)* 13(P3.6/INT2/WR_2/RxD_2)* 14(P3.7/INT3/RD_2/TxD_2)* 15(P5.6/XTALO/MCLKO_2/PWMAPS5_3)* 16(P5.7/XTALI/PWMAPS6_3)* 18(P4.0/SS_3/ADCETR_2/QSPINCS_2/I2SWS_4)* 19(P2.0/A8/T11/CCP0_3/PWM1P_3/ADCETR_3/I2SWS_3)* 21(P2.2/A10/CCP2_3/PWM2P_3/I2SMCLK_3)* 22(P2.3/A11/SDA/ECI_3/PWM2N_3/PWM6_3/PWM_ETI1_3/PWM_ETI2_3/I2SCK_3)* 26(P2.5/A13/MOSI_2/PWM3N_3/PWM7_3/QSPIIO0_3)* 27(P2.6/A14/MISO_2/PWM4P_3/QSPIIO1_3)* 28(P2.7/A15/SCLK_2/PWM4N_3/PWM8_3/QSPICLK_3)* 31(P4.1/CMPO_2/ECI_2/MOSI_3/PWMETI1_2/PWMETI2_2/QSPIIO0_2/I2SSD_4)* 33(P0.7/AD7/T4CLKO/PWM4N_2/PWM8/PWMFLT_3)* 34(P0.6/ADC14/AD6/T4/PWM4P_2/PWMFLT_2)* 42(QSPIIO1_2/CCP0_2/MISO_3/RxD2_2/WR/P4.2)* 43(PWM1P/T2/ADC0/P1.0)* 44(PWM5_2/PWM1N/CCP2/T2CLKO/ADC1/P1.1)* 45(QSPIIO3/PWMETI2_4/PWMETI1_4/PWM2P/ECI/RxD2/ADC2/P1.2)* 46(QSPIIO2/PWM6_2/PWM2N/CCP0/TxD2/ADC3/P1.3)* 47(I2SWS_2/QSPINCS/PWM3P/CCP1/SDA_2/SS/ADC4/P1.4)* 48(QSPIIO2_2/PWM7_4/RxD4_2/P5.2)*; U4 5(NC)* 7(NC)* 8(NC)* 21(NC)*; U5 1(QSPIIO3_2/PWM8_4/TxD4_2/P5.3)* 3(I2SMCLK_4/I2SMCLK_2/QSPIIO1/PWM4P/MISO/RxD_3/ADC6/P1.6)* 4(I2SCK_2/QSPICLK/PWM8_2/PWM4N/SCLK/TxD_3/ADC7/P1.7)* 5(PWMAPS6_2/QSPINCS_3/ADC_ETR/MCLKO/nRST/P4.7)* 7(I2SCK_4/QSPICLK_2/CCP1_2/SCLK_3/TxD2_2/RxD_4/P4.3)* 9(I2SCK/PWM_ETI2/PWM_ETI1/SCL_4/SCLK_4/INT0/P3.2)* 10(PWMAPS5/I2SMCLK/SDA_4/MISO_4/INT1/P3.3)* 11(PWMAPS6/I2SSD/MOSI_4/T1CLKO/T0/P3.4)* 12(I2SWS/PWMFLT/SS_4/T0CLKO/T1/P3.5)* 13(P3.6/INT2/WR_2/RxD_2)* 14(P3.7/INT3/RD_2/TxD_2)* 15(P5.6/XTALO/MCLKO_2/PWMAPS5_3)* 16(P5.7/XTALI/PWMAPS6_3)* 18(P4.0/SS_3/ADCETR_2/QSPINCS_2/I2SWS_4)* 19(P2.0/A8/T11/CCP0_3/PWM1P_3/ADCETR_3/I2SWS_3)* 21(P2.2/A10/CCP2_3/PWM2P_3/I2SMCLK_3)* 22(P2.3/A11/SDA/ECI_3/PWM2N_3/PWM6_3/PWM_ETI1_3/PWM_ETI2_3/I2SCK_3)* 26(P2.5/A13/MOSI_2/PWM3N_3/PWM7_3/QSPIIO0_3)* 27(P2.6/A14/MISO_2/PWM4P_3/QSPIIO1_3)* 28(P2.7/A15/SCLK_2/PWM4N_3/PWM8_3/QSPICLK_3)* 31(P4.1/CMPO_2/ECI_2/MOSI_3/PWMETI1_2/PWMETI2_2/QSPIIO0_2/I2SSD_4)* 33(P0.7/AD7/T4CLKO/PWM4N_2/PWM8/PWMFLT_3)* 34(P0.6/ADC14/AD6/T4/PWM4P_2/PWMFLT_2)* 42(QSPIIO1_2/CCP0_2/MISO_3/RxD2_2/WR/P4.2)* 43(PWM1P/T2/ADC0/P1.0)* 44(PWM5_2/PWM1N/CCP2/T2CLKO/ADC1/P1.1)* 45(QSPIIO3/PWMETI2_4/PWMETI1_4/PWM2P/ECI/RxD2/ADC2/P1.2)* 46(QSPIIO2/PWM6_2/PWM2N/CCP0/TxD2/ADC3/P1.3)* 47(I2SWS_2/QSPINCS/PWM3P/CCP1/SDA_2/SS/ADC4/P1.4)* 48(QSPIIO2_2/PWM7_4/RxD4_2/P5.2)*; U6 5(NC)* 7(NC)* 8(NC)* 21(NC)*
